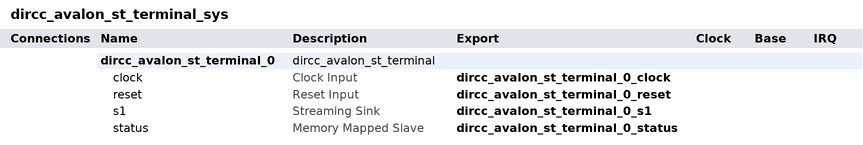
[diagram p0: system contents]
# Platform Designer (Qsys) system dircc_avalon_st_terminal_sys, Cyclone V 5CSEMA5F31C6
# Parameters at their usual value, and those the tool derives, are not listed.
package require qsys
create_system dircc_avalon_st_terminal_sys
set_project_property DEVICE_FAMILY {Cyclone V}
set_project_property DEVICE 5CSEMA5F31C6

add_instance dircc_avalon_st_terminal_0 dircc_avalon_st_terminal 1.0
set_instance_parameter_value dircc_avalon_st_terminal_0 DATA_WIDTH 32

# exported interfaces
add_interface dircc_avalon_st_terminal_0_clock clock sink
set_interface_property dircc_avalon_st_terminal_0_clock EXPORT_OF dircc_avalon_st_terminal_0.clock
add_interface dircc_avalon_st_terminal_0_reset reset sink
set_interface_property dircc_avalon_st_terminal_0_reset EXPORT_OF dircc_avalon_st_terminal_0.reset
add_interface dircc_avalon_st_terminal_0_s1 avalon_streaming sink
set_interface_property dircc_avalon_st_terminal_0_s1 EXPORT_OF dircc_avalon_st_terminal_0.s1
add_interface dircc_avalon_st_terminal_0_status avalon slave
set_interface_property dircc_avalon_st_terminal_0_status EXPORT_OF dircc_avalon_st_terminal_0.status

set_interconnect_requirement {$system} qsys_mm.clockCrossingAdapter HANDSHAKE
set_interconnect_requirement {$system} qsys_mm.enableEccProtection FALSE
set_interconnect_requirement {$system} qsys_mm.insertDefaultSlave FALSE
set_interconnect_requirement {$system} qsys_mm.maxAdditionalLatency 1

save_system dircc_avalon_st_terminal_sys.qsys
